# Altium schematic sheet Connectors.SchDoc
size A; SheetNumber: 8; SheetTotal: 10
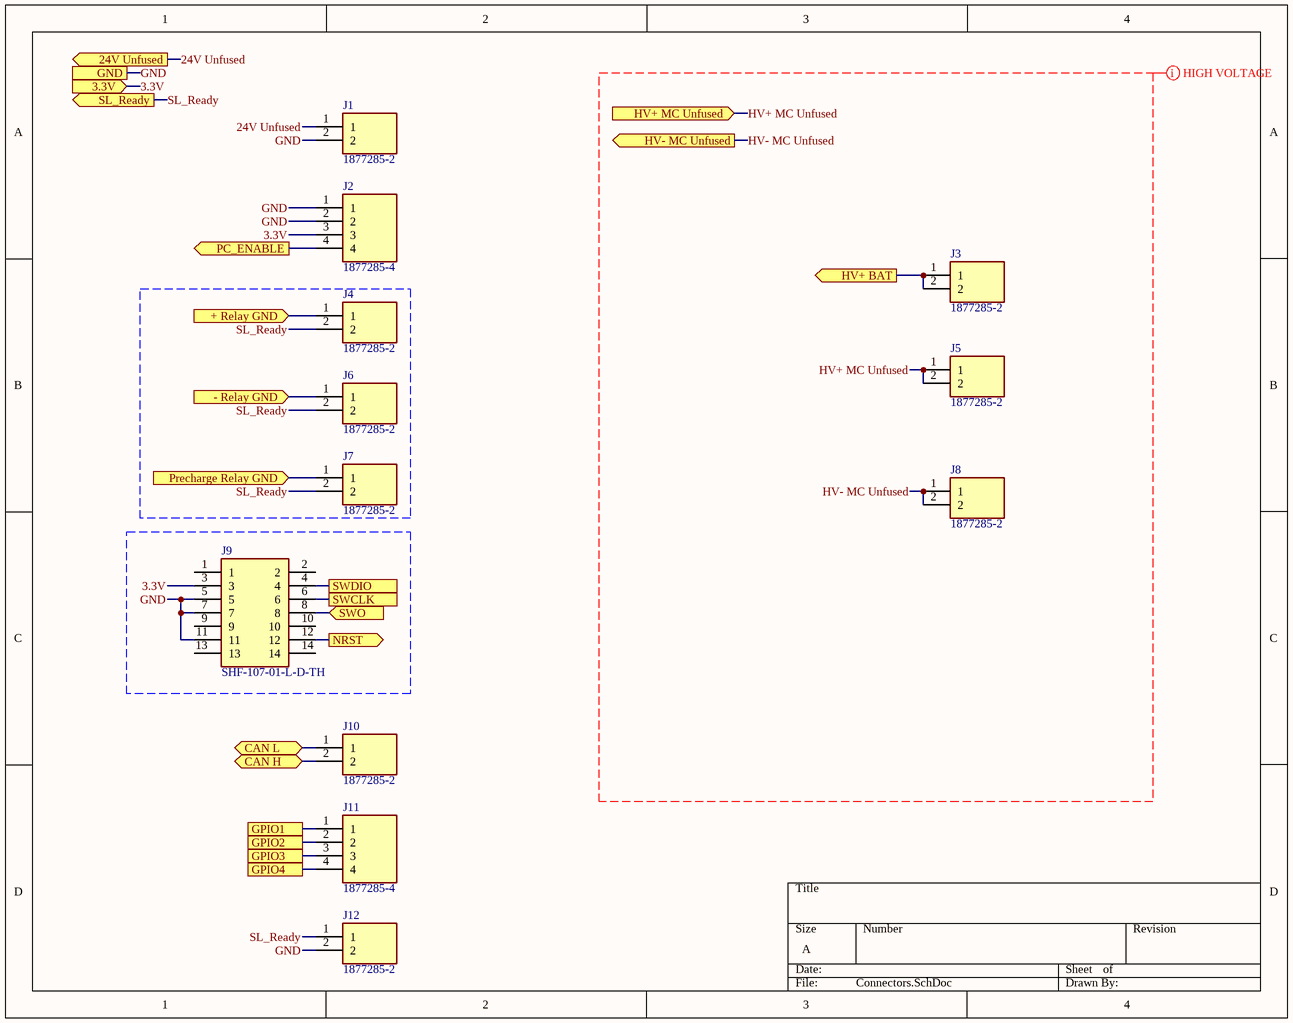
[diagram p0: Connectors.SchDoc]

## Parts
J1  1877285-2  [18772852]
J2  1877285-4  [18772854]
J3  1877285-2  [18772852]
J4  1877285-2  [18772852]
J5  1877285-2  [18772852]
J6  1877285-2  [18772852]
J7  1877285-2  [18772852]
J8  1877285-2  [18772852]
J9  SHF-107-01-L-D-TH  [SHF10701LDTH]
J10  1877285-2  [18772852]
J11  1877285-4  [18772854]
J12  1877285-2  [18772852]

## Ports
3.3V (in), 24V Unfused (out), + Relay GND (in), - Relay GND (in), CAN H (bidir), CAN L (bidir), GND, GPIO1, GPIO2, GPIO3, GPIO4, HV+ BAT (out), HV+ MC Unfused (in), HV- MC Unfused (out), NRST (out), PC_ENABLE (out), Precharge Relay GND (in), SL_Ready (out), SWCLK, SWDIO, SWO (in)

## Nets
3.3V: J2.3 J9.3 ; port 3.3V
24V Unfused: J1.1 ; port 24V Unfused
+ Relay GND: J4.1 ; port + Relay GND
- Relay GND: J6.1 ; port - Relay GND
CAN H: J10.2 ; port CAN H
CAN L: J10.1 ; port CAN L
GND: J1.2 J2.1 J2.2 J9.5 J9.7 J9.11 J12.2 ; port GND
GPIO1: J11.1 ; port GPIO1
GPIO2: J11.2 ; port GPIO2
GPIO3: J11.3 ; port GPIO3
GPIO4: J11.4 ; port GPIO4
HV+ BAT: J3.1 J3.2 ; port HV+ BAT
HV+ MC Unfused: J5.1 J5.2 ; port HV+ MC Unfused
HV- MC Unfused: J8.1 J8.2 ; port HV- MC Unfused
NRST: J9.12 ; port NRST
PC_ENABLE: J2.4 ; port PC_ENABLE
Precharge Relay GND: J7.1 ; port Precharge Relay GND
SL_Ready: J4.2 J6.2 J7.2 J12.1 ; port SL_Ready
SWCLK: J9.6 ; port SWCLK
SWDIO: J9.4 ; port SWDIO
SWO: J9.8 ; port SWO

Not connected (* = marked no-connect by the designer): J9 1 2 9 10 13 14

## Layout directives
mark named HIGH VOLTAGE: HV+ MC Unfused, HV- MC Unfused

## Library data of the parts
J1 J3-J8 J10 J12 = 1877285-2: Connector; Manufacturer_Name: TE Connectivity; Datasheet Link: https://www.te.com/commerce/DocumentDelivery/DDEController?Action=srchrtrv&DocNm=7-1773458-5_ECONOMY_POWER_QRG&DocType=Data%20Sheet&DocLang=English&PartCntxt=1877285-2&DocFormat=pdf; Height: 12mm; Manufacturer_Part_Number: 1877285-2; Mouser Part Number: 571-1877285-2; Mouser Price/Stock: https://www.mouser.co.uk/ProductDetail/TE-Connectivity/1877285-2?qs=ka3zfMQDmFlAIZq5pDt5JA%3D%3D; Arrow Part Number: 1877285-2; Arrow Price/Stock: https://www.arrow.com/en/products/1877285-2/te-connectivity?region=europe
J2 J11 = 1877285-4: Connector; Manufacturer_Name: TE Connectivity; Datasheet Link: https://www.te.com/commerce/DocumentDelivery/DDEController?Action=srchrtrv&DocNm=1877285&DocType=Customer%20Drawing&DocLang=English&PartCntxt=1877285-4&DocFormat=pdf; Height: 12.5mm; Manufacturer_Part_Number: 1877285-4; Mouser Part Number: 571-1877285-4; Mouser Price/Stock: https://www.mouser.co.uk/ProductDetail/TE-Connectivity/1877285-4?qs=ka3zfMQDmFkZPBtotDIXvQ%3D%3D; Arrow Part Number: 1877285-4; Arrow Price/Stock: https://www.arrow.com/en/products/1877285-4/te-connectivity?region=nac
J9 = SHF-107-01-L-D-TH: Connector; Manufacturer_Name: SAMTEC; Datasheet Link: https://componentsearchengine.com/Datasheets/1/SHF-107-01-L-D-TH.pdf; Height: 5.33mm; Manufacturer_Part_Number: SHF-107-01-L-D-TH; Mouser Part Number: 200-SHF10701LDTH; Mouser Price/Stock: https://www.mouser.co.uk/ProductDetail/Samtec/SHF-107-01-L-D-TH?qs=%252BZP6%2F%252BtExtDrbekpOnhfag%3D%3D; Arrow Part Number: SHF-107-01-L-D-TH; Arrow Price/Stock: https://www.arrow.com/en/products/shf-107-01-l-d-th/samtec?utm_currency=USD&region=nac